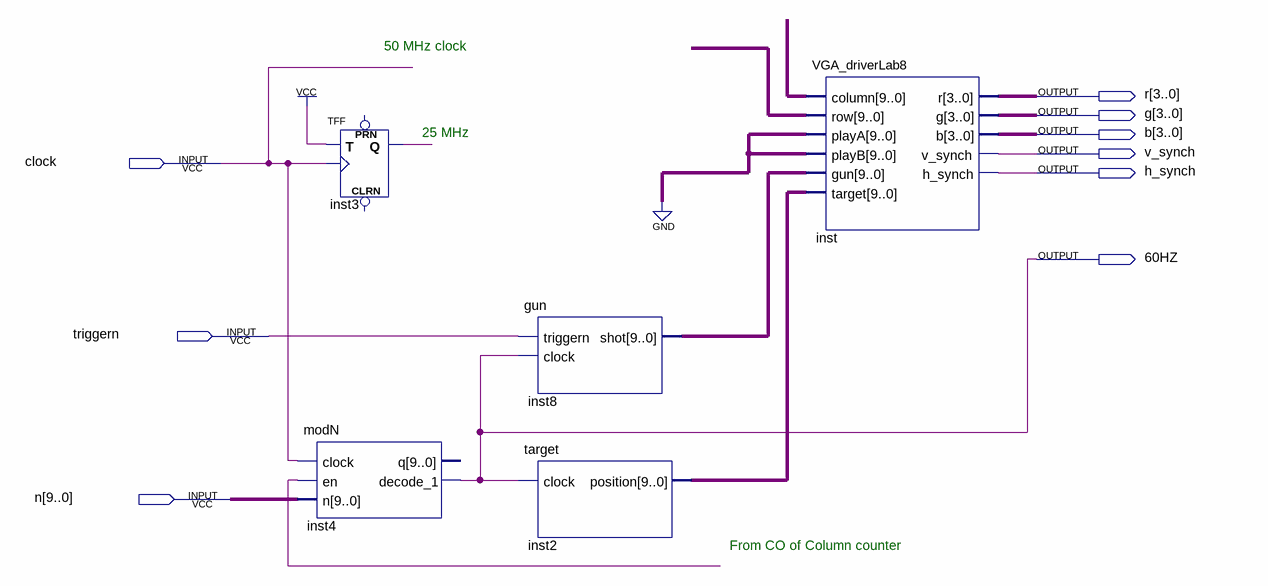
[diagram p0: schematic sheet]
// Quartus schematic system.bdf as structural Verilog: 5 symbols, 9 pins
module system (
  input  clock,
  input  triggern,
  input  [9:0] n,
  output [3:0] r,
  output [3:0] g,
  output [3:0] b,
  output v_synch,
  output h_synch,
  output \60HZ 
);

  wire inst3_q, undriven_3;
  wire [9:0] inst2_position, inst8_shot, undriven, undriven_2;

  modN inst4 (.clock(clock), .en(undriven_3), .n(n), .decode_1(\60HZ ));  // open: q
  TFF inst3 (.T(1'b1), .CLK(clock), .Q(inst3_q));  // open: PRN, CLRN
  gun inst8 (.triggern(triggern), .clock(\60HZ ), .shot(inst8_shot));
  target inst2 (.clock(\60HZ ), .position(inst2_position));
  VGA_driverLab8 inst (
    .column(undriven), .row(undriven_2), .playA({10{1'b0}}), .playB({10{1'b0}}), .gun(inst8_shot),
    .target(inst2_position), .r(r), .g(g), .b(b), .v_synch(v_synch), .h_synch(h_synch));

  // Notes on the sheet:
  //   50 MHz clock
  //   25 MHz 
  //   From CO of Column counter
endmodule
